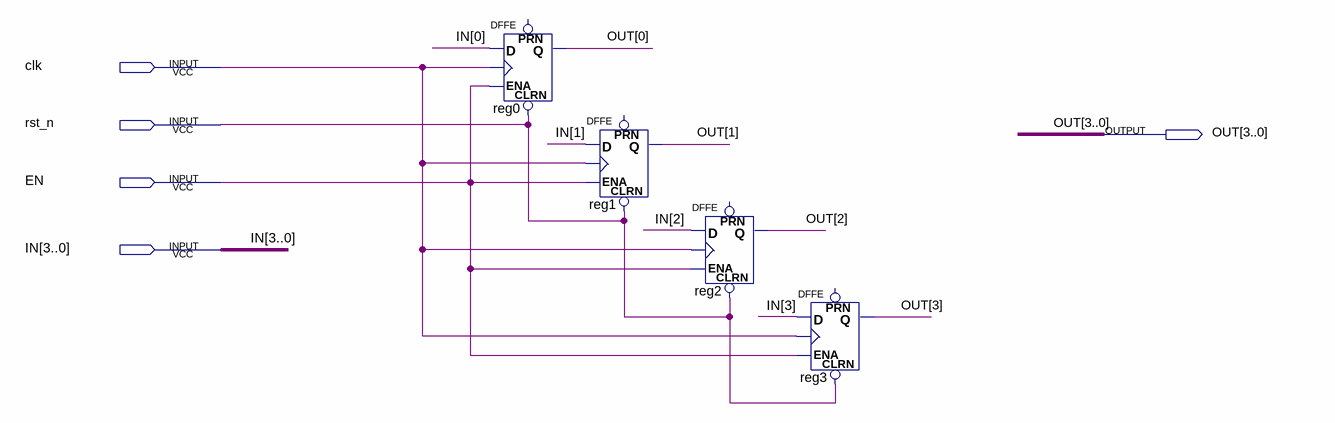
[diagram p0: schematic sheet]
// Quartus schematic Register_4_Bit.bdf as structural Verilog: 4 symbols, 5 pins
module Register_4_Bit (
  input  clk,
  input  rst_n,
  input  EN,
  input  [3:0] IN,
  output [3:0] OUT
);

  DFFE reg0 (.CLRN(rst_n), .D(IN[0]), .CLK(clk), .ENA(EN), .Q(OUT[0]));  // open: PRN
  DFFE reg1 (.CLRN(rst_n), .D(IN[1]), .CLK(clk), .ENA(EN), .Q(OUT[1]));  // open: PRN
  DFFE reg2 (.CLRN(rst_n), .D(IN[2]), .CLK(clk), .ENA(EN), .Q(OUT[2]));  // open: PRN
  DFFE reg3 (.CLRN(rst_n), .D(IN[3]), .CLK(clk), .ENA(EN), .Q(OUT[3]));  // open: PRN
endmodule
